# EAGLE design RasperryPI_OneWire (EAGLE 7.2.0)
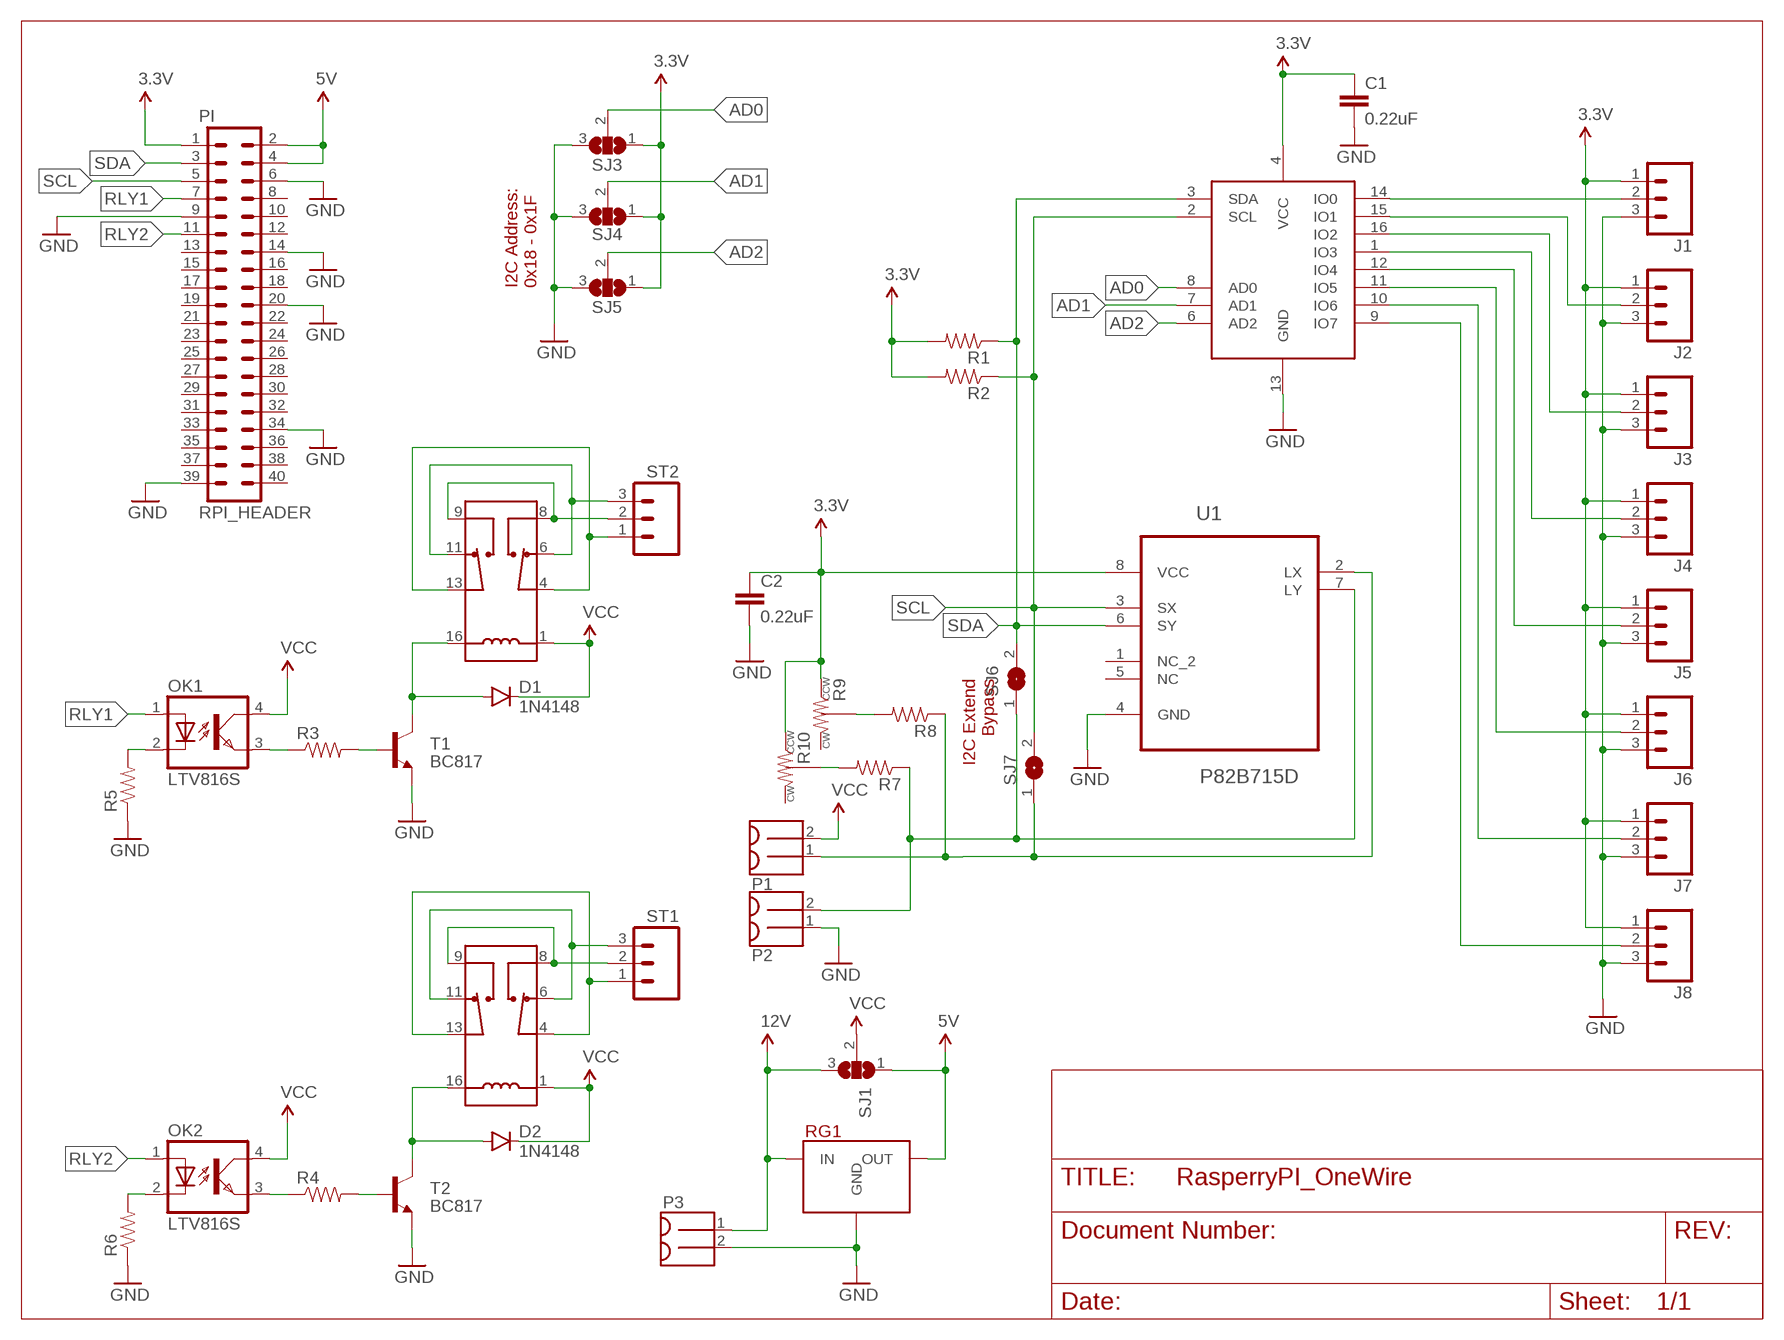
[diagram p0: schematic, sheet 1]

## Parts
C1  0.22uF  0.22UF-25V-10%(0603)  [0603-CAP]
C2  0.22uF  0.22UF-25V-10%(0603)  [0603-CAP]
D1  1N4148  DIODE1N4148  [DIODE-1N4148]
D2  1N4148  DIODE1N4148  [DIODE-1N4148]
J1  M03PTH  [1X03]
J2  M03PTH  [1X03]
J3  M03PTH  [1X03]
J4  M03PTH  [1X03]
J5  M03PTH  [1X03]
J6  M03PTH  [1X03]
J7  M03PTH  [1X03]
J8  M03PTH  [1X03]
OK1  LTV816S  [SMD4]
OK2  LTV816S  [SMD4]
P1  MOLEX_MINILITE_TRAP_2  [MOLEX_MINILITE_TRAP_2]
P2  MOLEX_MINILITE_TRAP_2  [MOLEX_MINILITE_TRAP_2]
P3  MOLEX_MINILITE_TRAP_2  [MOLEX_MINILITE_TRAP_2]
PI  RPI_HEADER  [RPI_HEADER]
R1  RESISTOR0805-RES  [0805]
R2  RESISTOR0805-RES  [0805]
R3  RESISTOR0805-RES  [0805]
R4  RESISTOR0805-RES  [0805]
R5  RESISTOR0805-RES  [0805]
R6  RESISTOR0805-RES  [0805]
R7  RESISTOR0805-RES  [0805]
R8  RESISTOR0805-RES  [0805]
R9  POT_3MM  [POT_3MM]
R10  POT_3MM  [POT_3MM]
RG1  MURATA_REG  [MURATA_REG_HOR]
RLY1  HK19F_5V_DPDT_RELAY  [DIP16-RELAY]
RLY2  HK19F_5V_DPDT_RELAY  [DIP16-RELAY]
SJ1  SJ2W  [SJ_2]
SJ3  SJ2W  [SJ_2]
SJ4  SJ2W  [SJ_2]
SJ5  SJ2W  [SJ_2]
SJ6  SJ  [SJ]
SJ7  SJ  [SJ]
ST1  SCREWTERM_3  [SCREWTERM_0.2X3]
ST2  SCREWTERM_3  [SCREWTERM_0.2X3]
T1  BC817  [SOT-23]
T2  BC817  [SOT-23]
U1  P82B715D  [SOIC127P600X175-8N]
U2  DS2482-800  [SOIC16]

## Nets
3.3V: C1.1 C2.1 J1.1 J2.1 J3.1 J4.1 J5.1 J6.1 J7.1 J8.1 PI.1 R1.2 R2.2 R9.1 R10.1 SJ3.1 SJ4.1 SJ5.1 U1.8(VCC) U2.4(VCC)
5V: PI.2 PI.4 RG1.3(OUT) SJ1.1
12V: P3.1 RG1.1(IN) SJ1.3
AD0: SJ3.2 U2.8(AD0)
AD1: SJ4.2 U2.7(AD1)
AD2: SJ5.2 U2.6(AD2)
GND: C1.2 C2.2 J1.3 J2.3 J3.3 J4.3 J5.3 J6.3 J7.3 J8.3 P2.1 P3.2 PI.6 PI.9 PI.14 PI.20 PI.34 PI.39 R5.1 R6.1 RG1.2(GND) SJ3.3 SJ4.3 SJ5.3 T1.2(E) T2.2(E) U1.4(GND) U2.13(GND)
LCL: P1.1 R8.1 SJ7.1 U1.2(LX)
LDA: P2.2 R7.1 SJ6.1 U1.7(LY)
N$1: J1.2 U2.14(IO0)
N$2: J2.2 U2.15(IO1)
N$3: J3.2 U2.16(IO2)
N$4: J4.2 U2.1(IO3)
N$5: J5.2 U2.12(IO4)
N$6: J6.2 U2.11(IO5)
N$7: J7.2 U2.10(IO6)
N$10: J8.2 U2.9(IO7)
N$11: OK2.3(EMIT) R4.1
N$12: R4.2 T2.1(B)
N$13: D2.A RLY2.16(L2) T2.3(C)
N$14: D1.A RLY1.16(L2) T1.3(C)
N$15: R3.2 T1.1(B)
N$16: OK1.3(EMIT) R3.1
N$17: RLY2.4(C1) RLY2.13(C2) ST1.1
N$18: RLY2.6(NC1) RLY2.11(NC2) ST1.3
N$19: RLY2.8(NO1) RLY2.9(NO2) ST1.2
N$20: RLY1.4(C1) RLY1.13(C2) ST2.1
N$21: RLY1.6(NC1) RLY1.11(NC2) ST2.3
N$22: RLY1.8(NO1) RLY1.9(NO2) ST2.2
N$23: OK1.2(C) R5.2
N$24: OK2.2(C) R6.2
N$25: R7.2 R10.2
N$26: R8.2 R9.2
RLY1: OK1.1(A) PI.7
RLY2: OK2.1(A) PI.11
SCL: PI.5 R2.1 SJ7.2 U1.3(SX) U2.2(SCL)
SDA: PI.3 R1.1 SJ6.2 U1.6(SY) U2.3(SDA)
VCC: D1.C D2.C OK1.4(COL) OK2.4(COL) P1.2 RLY1.1(L1) RLY2.1(L1) SJ1.2
Unconnected: PI.8 PI.10 PI.12 PI.13 PI.15 PI.16 PI.17 PI.18 PI.19 PI.21 PI.22 PI.23 PI.24 PI.25 PI.26 PI.27 PI.28 PI.29 PI.30 PI.31 PI.32 PI.33 PI.35 PI.36 PI.37 PI.38 PI.40 R9.3 R10.3 U1.1(NC_2) U1.5(NC)

## Notes on the sheet
- I2C Address: 
  0x18 - 0x1F
- I2C Extend
  Bypass

## Library data of the parts
C1 C2 = SparkFun-Capacitors:0.22UF-25V-10%(0603): CAP-07822; PROD_ID: CAP-07822
D1 D2 = SparkFun-DiscreteSemi:DIODE: Diode These are standard reverse protection diodes and small signal diodes. SMA package can handle up to about 1A. SOD-323 can handle about 200mA. What the SOD-323 package when ordering, there are some mfgs out there that are 5-pin packages.; PROD_ID: DIO-08378
J1-J8 = SparkFun-Connectors:M03: Header 3 Standard 3-pin 0.1" header. Use with straight break away headers (SKU : PRT-00116), right angle break away headers (PRT-00553), swiss pins (PRT-00743), machine pins (PRT-00117), and female headers (PRT-00115). Molex polarized connector foot print use with SKU : PRT-08232 with associated crimp pins and housings.
OK1 OK2 = optocoupler:LTV816: OPTO COUPLER Source: LITEON, LTV816.pdf; OC_FARNELL: unknown; OC_NEWARK: unknown
P1-P3 = Puffin:MOLEX_MINILITE_TRAP_2
PI = Puffin:RPI_HEADER
R1-R8 = SparkFun-Resistors:RESISTOR: Resistor Basic schematic elements and footprints for 0603, 1206, and PTH resistors.
R9 R10 = Puffin:POT_3MM
RG1 = Puffin:MURATA_REG
RLY1 RLY2 = Puffin:HK19F_5V_DPDT_RELAY: Subminiture DPDT DIP relay
SJ1 SJ3-SJ5 = jumper:SJ2W: SMD solder JUMPER
SJ6 SJ7 = jumper:SJ: SMD solder JUMPER
ST1 ST2 = Puffin:SCREWTERM_3
T1 T2 = Puffin:BC817
U1 = Texas Instruments_By_element14_Batch_1:P82B715D: I2C BUS EXTENDER; MPN: P82B715D; OC_FARNELL: 1604945; OC_NEWARK: 84M9793; PACKAGE: SOIC-8; SUPPLIER: Texas Instruments
U2 = Puffin:DS2482-800: DS2482-800 I2C-to-1-Wire® bridge device with 8 inputs

## Board
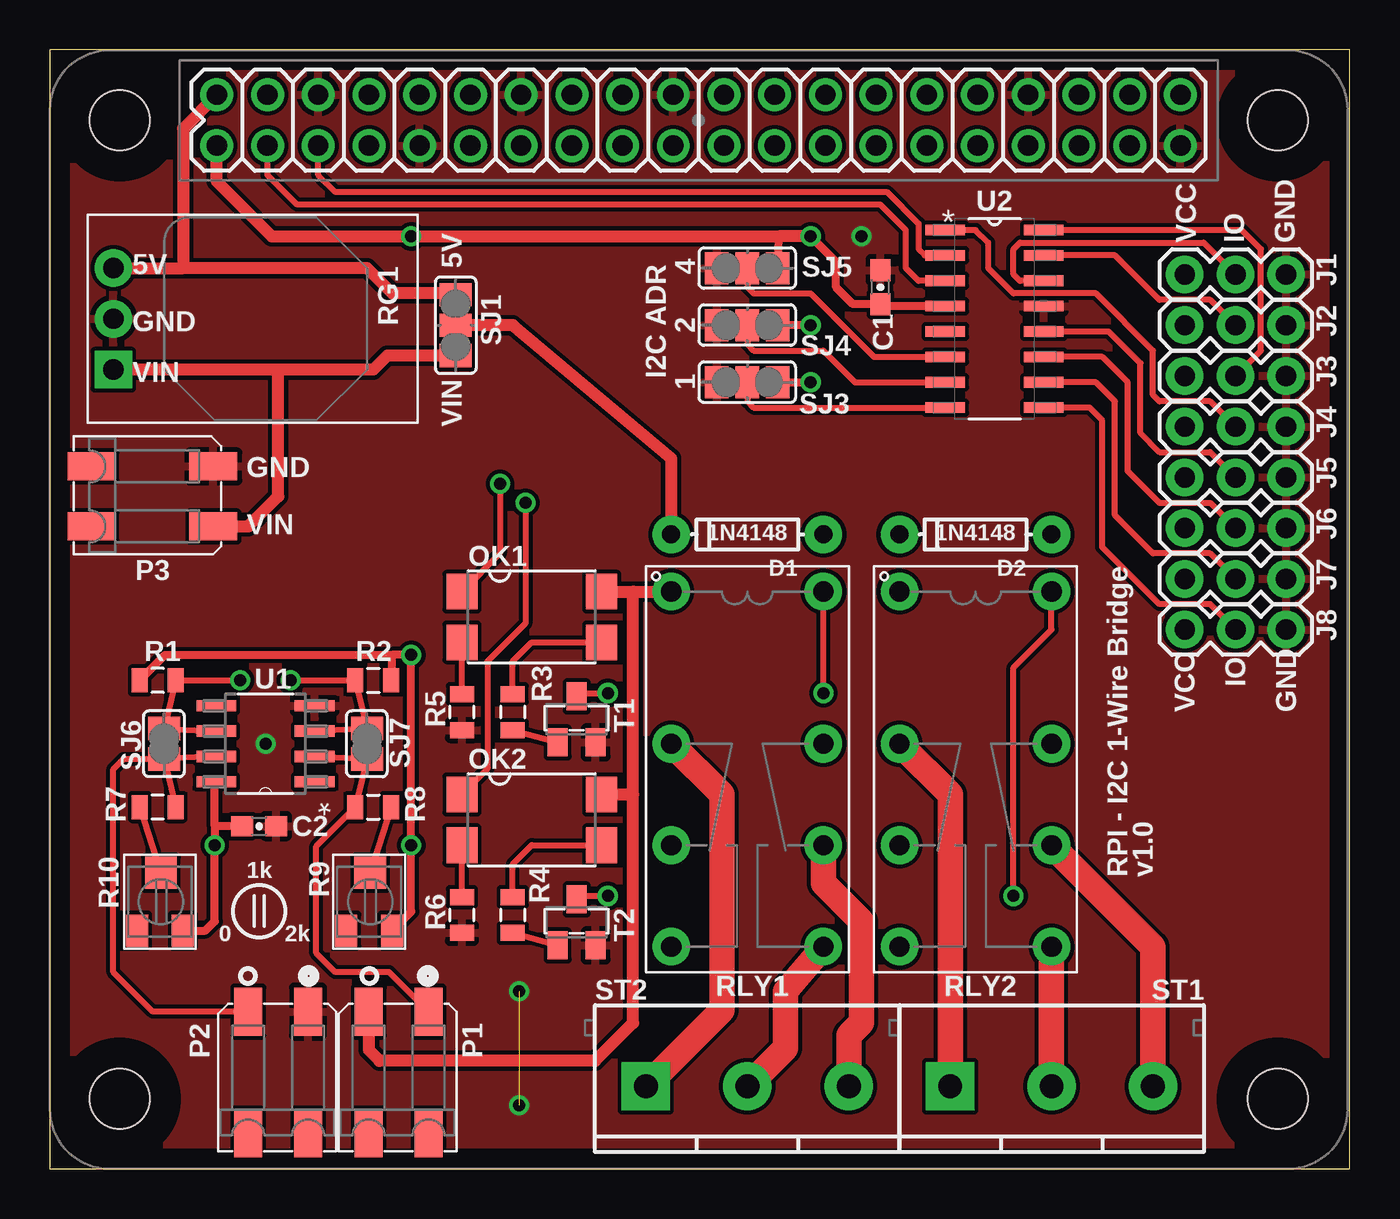
[diagram p1: board, top side]
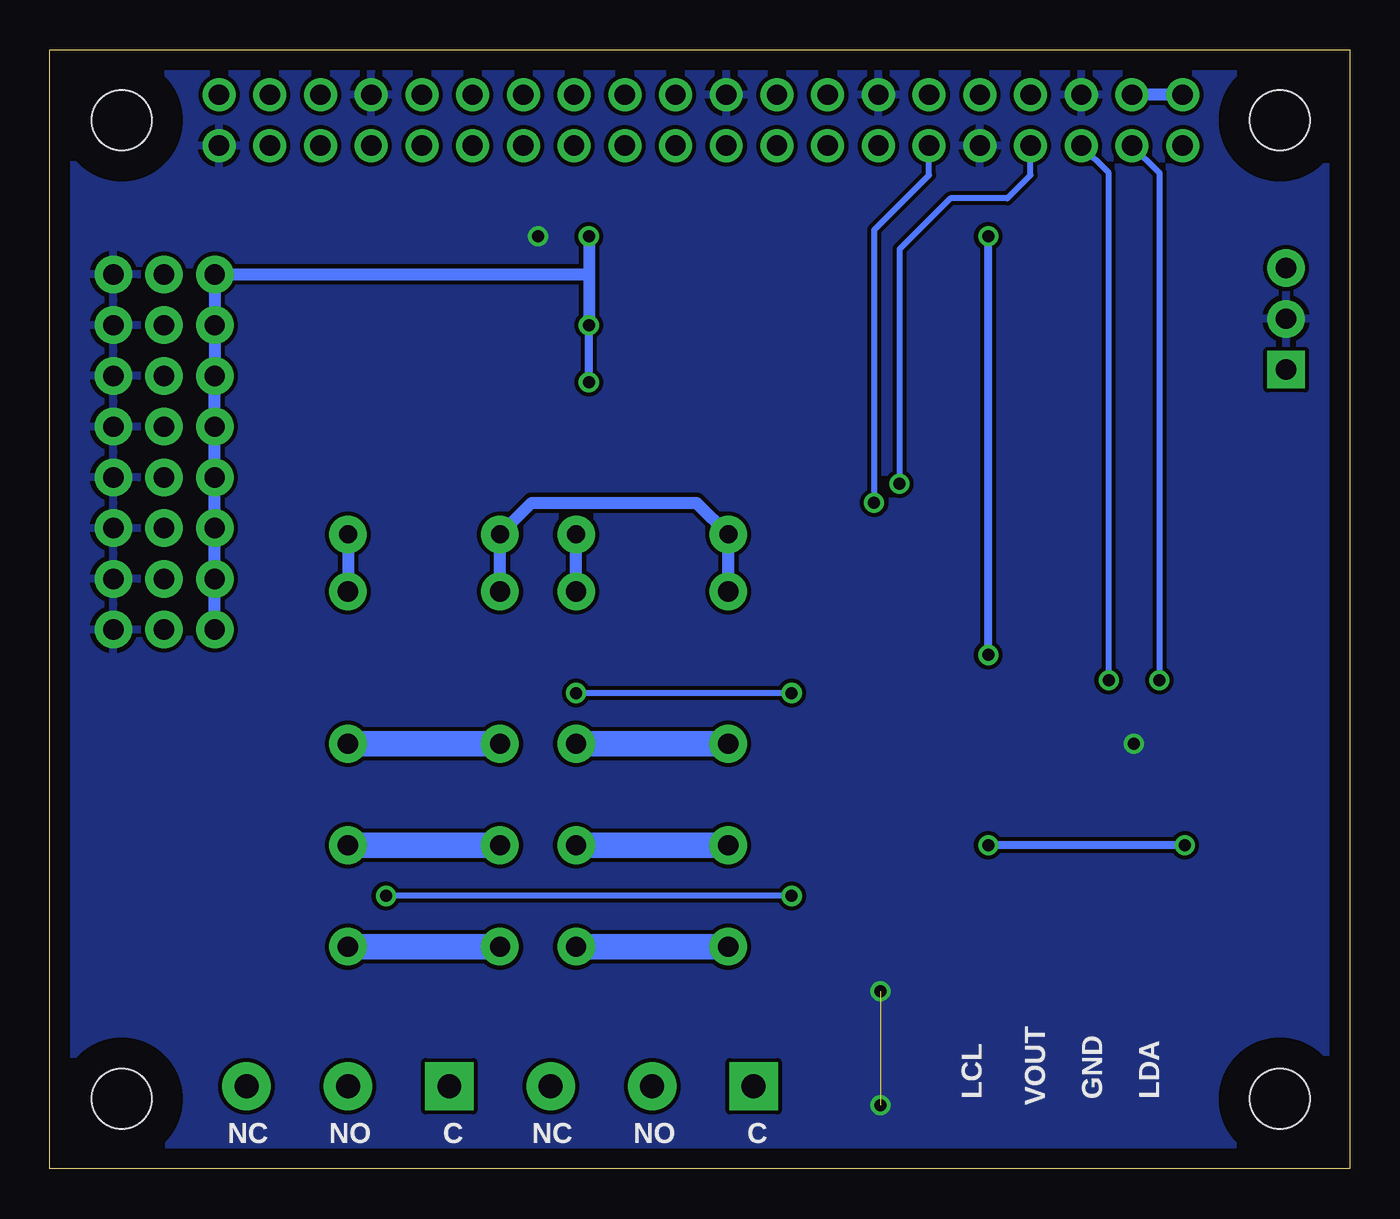
[diagram p2: board, bottom side, seen from below]

Size 65.09 x 56.01 mm. Coordinates in mm from the lower left corner, seen from the top.
Outline: 0,0 65.09,0 65.09,56.01 0,56.01 0,0
Copper layers (1*16): Top 0.035mm / dielectric 1.5mm / Bottom 0.035mm
Design rules "default": minimum track width 10mil, minimum drill 24mil, track to track 8mil, track to pad 8mil, pad to pad 8mil, via to via 8mil, smd to smd 8mil, copper to edge 40mil, drill to drill 8mil, minimum pad ring 10mil, minimum via ring 8mil, stop-mask expansion 4mil, vias tented up to drill 0mil, thermal gap 10mil

### Footprints (pad centres in the part's own frame; a part is rotated, then mirrored left to right if it is on the bottom)
0603-CAP = smd 1.1 x 1: 1 -0.85,0; 2 0.85,0
DIODE-1N4148 = drill 0.9 pad 1.88: A -3.81,0; C 3.81,0
1X03 = drill 1.016 pad 1.88: 1 0,0; 2 2.54,0; 3 5.08,0
SMD4 = smd 1.78 x 1.55: 1 -1.27,-3.5; 2 1.27,-3.5; 3 1.27,3.5; 4 -1.27,3.5
MOLEX_MINILITE_TRAP_2 = smd 2.4 x 1.4: 1 -3.1,1.5; 2 -3.1,-1.5; 3 3,1.5; 4 3,-1.5
RPI_HEADER = drill 1.016 pad 1.651: 1 -24.13,-1.27; 2 -24.13,1.27; 3 -21.59,-1.27; 4 -21.59,1.27; 5 -19.05,-1.27; 6 -19.05,1.27; 7 -16.51,-1.27; 8 -16.51,1.27; 9 -13.97,-1.27; 10 -13.97,1.27; 11 -11.43,-1.27; 12 -11.43,1.27; 13 -8.89,-1.27; 14 -8.89,1.27; 15 -6.35,-1.27; 16 -6.35,1.27; 17 -3.81,-1.27; 18 -3.81,1.27; 19 -1.27,-1.27; 20 -1.27,1.27; 21 1.27,-1.27; 22 1.27,1.27; 23 3.81,-1.27; 24 3.81,1.27; 25 6.35,-1.27; 26 6.35,1.27; 27 8.89,-1.27; 28 8.89,1.27; 29 11.43,-1.27; 30 11.43,1.27; 31 13.97,-1.27; 32 13.97,1.27; 33 16.51,-1.27; 34 16.51,1.27; 35 19.05,-1.27; 36 19.05,1.27; 37 21.59,-1.27; 38 21.59,1.27; 39 24.13,-1.27; 40 24.13,1.27
0805 = smd 0.8 x 1.2: 1 -0.9,0; 2 0.9,0
POT_3MM = smd 1.1 x 1.6: 1 2.85,0.8; 3 0.55,0.8 | smd 1.6 x 1.6: 2 1.75,3.7
MURATA_REG_HOR = drill 1.016 pad 1.88 square: 1 2.54,0 | drill 1.016 pad 1.88: 2 0,0; 3 -2.54,0
DIP16-RELAY = drill 1.016 pad 1.88: 1 -8.89,-3.81; 4 -1.27,-3.81; 6 3.81,-3.81; 8 8.89,-3.81; 9 8.89,3.81; 11 3.81,3.81; 13 -1.27,3.81; 16 -8.89,3.81
SJ_2 = smd 1.168 x 1.6: 1 -1.524,0; 2 0,0; 3 1.524,0
SJ = smd 1.168 x 1.6: 1 -0.762,0; 2 0.762,0
SCREWTERM_0.2X3 = drill 1.2 pad 2.413 square: 1 0,0 | drill 1.2 pad 2.413: 2 5.08,0; 3 10.16,0
SOT-23 = smd 1 x 1.4: 1 -0.92,-1.2; 2 0.98,-1.2; 3 0.03,1.1
SOIC127P600X175-8N = smd 1.981 x 0.559: 1 -2.464,1.905; 2 -2.464,0.635; 3 -2.464,-0.635; 4 -2.464,-1.905; 5 2.464,-1.905; 6 2.464,-0.635; 7 2.464,0.635; 8 2.464,1.905
SOIC16 = smd 1.981 x 0.533: 1 -2.464,4.445; 2 -2.464,3.175; 3 -2.464,1.905; 4 -2.464,0.635; 5 -2.464,-0.635; 6 -2.464,-1.905; 7 -2.464,-3.175; 8 -2.464,-4.445; 9 2.464,-4.445; 10 2.464,-3.175; 11 2.464,-1.905; 12 2.464,-0.635; 13 2.464,0.635; 14 2.464,1.905; 15 2.464,3.175; 16 2.464,4.445
RPI_BOARD = hole 3: 0,0; 0,49; 58,0; 58,49

### Placement (x,y rotation side)
C1  41.59,44.13 90 top
C2  10.48,17.14 0 top
D1  34.92,31.75 180 top
D2  46.35,31.75 180 top
J1  56.83,44.77 0 top
J2  56.83,42.23 0 top
J3  56.83,39.69 0 top
J4  56.83,37.15 0 top
J5  56.83,34.61 0 top
J6  56.83,32.07 0 top
J7  56.83,29.53 0 top
J8  56.83,26.99 0 top
OK1  24.13,27.62 270 top
OK2  24.13,17.46 270 top
P1  17.46,4.76 270 top
P2  11.43,4.76 270 top
P3  5.08,33.66 180 top
PI  32.49,52.49 0 top
R1  5.4,24.45 180 top
R2  16.19,24.45 0 top
R3  23.18,22.86 270 top
R4  23.18,12.7 270 top
R5  20.64,22.86 90 top
R6  20.64,12.7 90 top
R7  5.4,18.1 180 top
R8  16.19,18.1 0 top
R9  14.29,11.11 0 top
R10  3.81,11.11 0 top
RG1  3.17,42.55 270 top
RLY1  34.92,20 270 top
RLY2  46.35,20 270 top
SJ1  20.32,42.23 270 top
SJ3  34.92,39.37 180 top
SJ4  34.92,42.23 180 top
SJ5  34.92,45.09 180 top
SJ6  5.71,21.27 90 top
SJ7  15.88,21.27 90 top
ST1  45.09,4.13 0 top
ST2  29.84,4.13 0 top
T1  26.35,22.54 0 top
T2  26.35,12.38 0 top
U1  10.79,21.27 180 top
U2  47.31,42.55 0 top
U$6  [RPI_BOARD]  3.49,3.49 0 top

### Tracks (layer width: path | path; a pad name or v marks a point on that pad's centre or on a via)
3.3V  (via drill 0.6)
  Top 0.406: SJ3.1 v38.1,39.37 | v38.1,42.23 SJ4.1 | U2.4 41.7,43.18 C1.1 40.22,43.28 39.37,44.13 39.37,45.4 v38.1,46.67 | SJ5.1 36.51,46.67 | R10.1 7.79,11.91 8.26,12.38 v8.26,16.19 8.26,17.14 | 8.26,17.14 8.26,19.29 U1.8 | C2.1 8.26,17.14 | R1.2 5.77,25.72 17.14,25.72 | R2.2 17.14,24.5 17.14,25.72 | 17.14,25.72 v18.1,25.72 v18.1,16.19 18.1,12.87 R9.1
  Top 0.61: v38.1,46.67 36.51,46.67 v18.1,46.67 11.11,46.67 8.36,49.43 PI.1
  Bottom 0.406: v38.1,39.37 v38.1,42.23 | v8.26,16.19 v18.1,16.19 | v18.1,25.72 v18.1,46.67
  Bottom 0.61: v38.1,46.67 38.1,44.77 | 38.1,44.77 v38.1,42.23 | J8.1 J7.1 J6.1 J5.1 J4.1 J3.1 J2.1 J1.1 38.1,44.77
5V
  Top 0.61: PI.2 6.67,52.07 6.67,45.09 | RG1.3 6.67,45.09 | SJ1.1 20.26,43.81 17.14,43.81 15.88,45.09 6.67,45.09
  Bottom 0.61: PI.2 PI.4
12V
  Top 0.61: SJ1.3 16.89,40.7 16.19,40.01 11.43,40.01 | 11.43,40.01 RG1.1 | P3.1 9.93,32.16 11.43,33.66 11.43,40.01
AD0
  Top 0.305: SJ3.2 34.92,38.42 35.24,38.1 U2.8
AD1
  Top 0.305: SJ4.2 34.92,41.27 35.24,40.96 38.73,40.96 40.32,39.37 U2.7
AD2
  Top 0.305: SJ5.2 34.92,44.13 35.24,43.81 38.1,43.81 41.27,40.64 U2.6
GND  (via drill 0.6)  (1 unrouted)
  other vias: 40.64,46.67 10.79,21.27 23.5,8.89 23.5,3.17
  pour Bottom: -1.59,56.2 65.41,56.2 65.41,-0.32 -1.59,-0.32
  pour Top: -1.27,56.52 65.72,56.52 65.72,-0.64 -1.27,-0.64
LCL
  Top 0.305: U1.2 SJ7.1 R8.1 13.34,16.14 13.34,10.79 14.29,9.84 16.98,9.84 P1.1
LDA
  Top 0.305: SJ6.1 R7.1 | U1.7 SJ6.1 | SJ6.1 3.68,20.51 3.17,20 3.17,9.84 5.16,7.86 P2.2
N$1
  Top 0.305: U2.14 48.58,44.45 48.26,44.77 48.26,46.04 48.58,46.35 57.78,46.35 J1.2
N$2
  Top 0.305: J2.2 58.1,43.5 55.56,43.5 53.34,45.72 U2.15
N$3
  Top 0.305: J3.2 60.64,40.96 60.64,46.04 59.69,46.99 U2.16
N$4
  Top 0.305: U2.1 46.35,46.99 46.99,46.35 46.99,45.09 48.26,43.81 52.39,43.81 55.24,40.96 55.24,38.73 55.56,38.42 58.1,38.42 J4.2
N$5
  Top 0.305: U2.12 53.02,41.91 54.61,40.32 54.61,36.83 55.56,35.88 58.1,35.88 J5.2
N$6
  Top 0.305: U2.11 52.7,40.64 53.98,39.37 53.98,34.92 55.56,33.34 58.1,33.34 J6.2
N$7
  Top 0.305: U2.10 52.39,39.37 53.34,38.42 53.34,32.7 55.24,30.8 58.1,30.8 J7.2
N$10
  Top 0.305: U2.9 52.07,38.1 52.7,37.47 52.7,31.11 55.56,28.26 58.1,28.26 J8.2
N$11
  Top 0.305: R4.1 23.18,15.24 24.13,16.19 OK2.3
N$12
  Top 0.305: R4.2 T2.1
N$13  (via drill 0.6)
  Top 0.305: T2.3 26.55,13.65 v27.94,13.65 | v48.26,13.65 48.26,25.08 50.16,26.99 RLY2.16
  Bottom 0.305: v27.94,13.65 v48.26,13.65
  Bottom 0.61: D2.A RLY2.16
N$14  (via drill 0.6)
  Top 0.305: T1.3 26.55,23.81 v27.94,23.81 | v38.73,23.81 RLY1.16
  Bottom 0.305: v27.94,23.81 v38.73,23.81
  Bottom 0.61: RLY1.16 D1.A
N$15
  Top 0.305: R3.2 T1.1
N$16
  Top 0.305: R3.1 23.18,25.4 24.13,26.35 OK1.3
N$17
  Top 1.27: ST1.1 45.09,18.73 RLY2.4
  Bottom 1.27: RLY2.13 RLY2.4
N$18
  Top 1.27: RLY2.11 55.24,11.11 ST1.3
  Bottom 1.27: RLY2.6 RLY2.11
N$19
  Top 1.27: RLY2.9 ST1.2
  Bottom 1.27: RLY2.8 RLY2.9
N$20
  Top 1.27: ST2.1 33.66,7.94 33.66,18.73 RLY1.4
  Bottom 1.27: RLY1.4 RLY1.13
N$21
  Top 1.27: RLY1.11 38.73,14.29 40.64,12.38 40.64,7.3 40.01,6.67 ST2.3
  Bottom 1.27: RLY1.6 RLY1.11
N$22
  Top 1.27: RLY1.9 36.83,8.89 36.83,6.03 ST2.2
  Bottom 1.27: RLY1.8 RLY1.9
N$23
  Top 0.305: R5.2 OK1.2
N$24
  Top 0.305: R6.2 OK2.2
N$25
  Top 0.305: R7.2 R10.2
N$26
  Top 0.305: R8.2 R9.2
RLY1  (via drill 0.6)
  Top 0.305: v22.54,34.29 22.54,30.8 OK1.1
  Bottom 0.305: v22.54,34.29 22.54,46.04 20,48.58 17.14,48.58 15.98,49.75 PI.7
RLY2  (via drill 0.6)
  Top 0.305: v23.81,33.34 23.81,27.3 21.91,25.4 21.91,20.01 OK2.1
  Bottom 0.305: v23.81,33.34 23.81,46.99 21.06,49.75 PI.11
SCL  (via drill 0.6)
  Top 0.305: U2.2 43.81,45.72 43.5,46.04 43.5,47.31 41.91,48.9 14.29,48.9 13.44,49.75 PI.5 | U1.3 SJ7.2 R2.1 v12.06,24.45
  Bottom 0.305: v12.06,24.45 12.06,49.85 PI.5
SDA  (via drill 0.6)
  Top 0.305: U2.3 43.5,44.45 42.86,45.09 42.86,46.99 41.59,48.26 12.38,48.26 10.9,49.75 PI.3 | U1.6 SJ6.2 R1.1 v9.53,24.45
  Bottom 0.305: PI.3 9.53,49.85 v9.53,24.45
VCC
  Top 0.61: OK1.4 29.21,28.89 | 29.21,28.89 RLY1.1 | 27.94,18.73 OK2.4 29.21,18.73 | 29.21,18.73 29.21,7.3 27.3,5.4 16.51,5.4 15.96,5.95 P1.2 | 29.21,18.73 29.21,28.89 | D1.C 31.11,35.56 23.18,42.23 SJ1.2
  Bottom 0.61: RLY2.1 D2.C 40.96,33.34 32.7,33.34 D1.C RLY1.1

### Text on the board
tPlace: VCC | IO | GND | 5V | 5V | 4 | GND | 2 | I2C ADR | VIN | 1 | VIN | GND | VIN | IO | VCC | GND | 1k | RPI - I2C 1-Wire Bridge | v1.0 | 0 | 2k
bPlace: LDA | GND | VOUT | LCL | C | NO | NC | C | NO | NC
tDocu: SDA | SCL